# EAGLE schematic fpga_board_test (EAGLE 9.5.1)
Control Board
REVISION: v3.0; TEAM: RoboCup SSL

## Sheet 1 of 4: Microcontroller
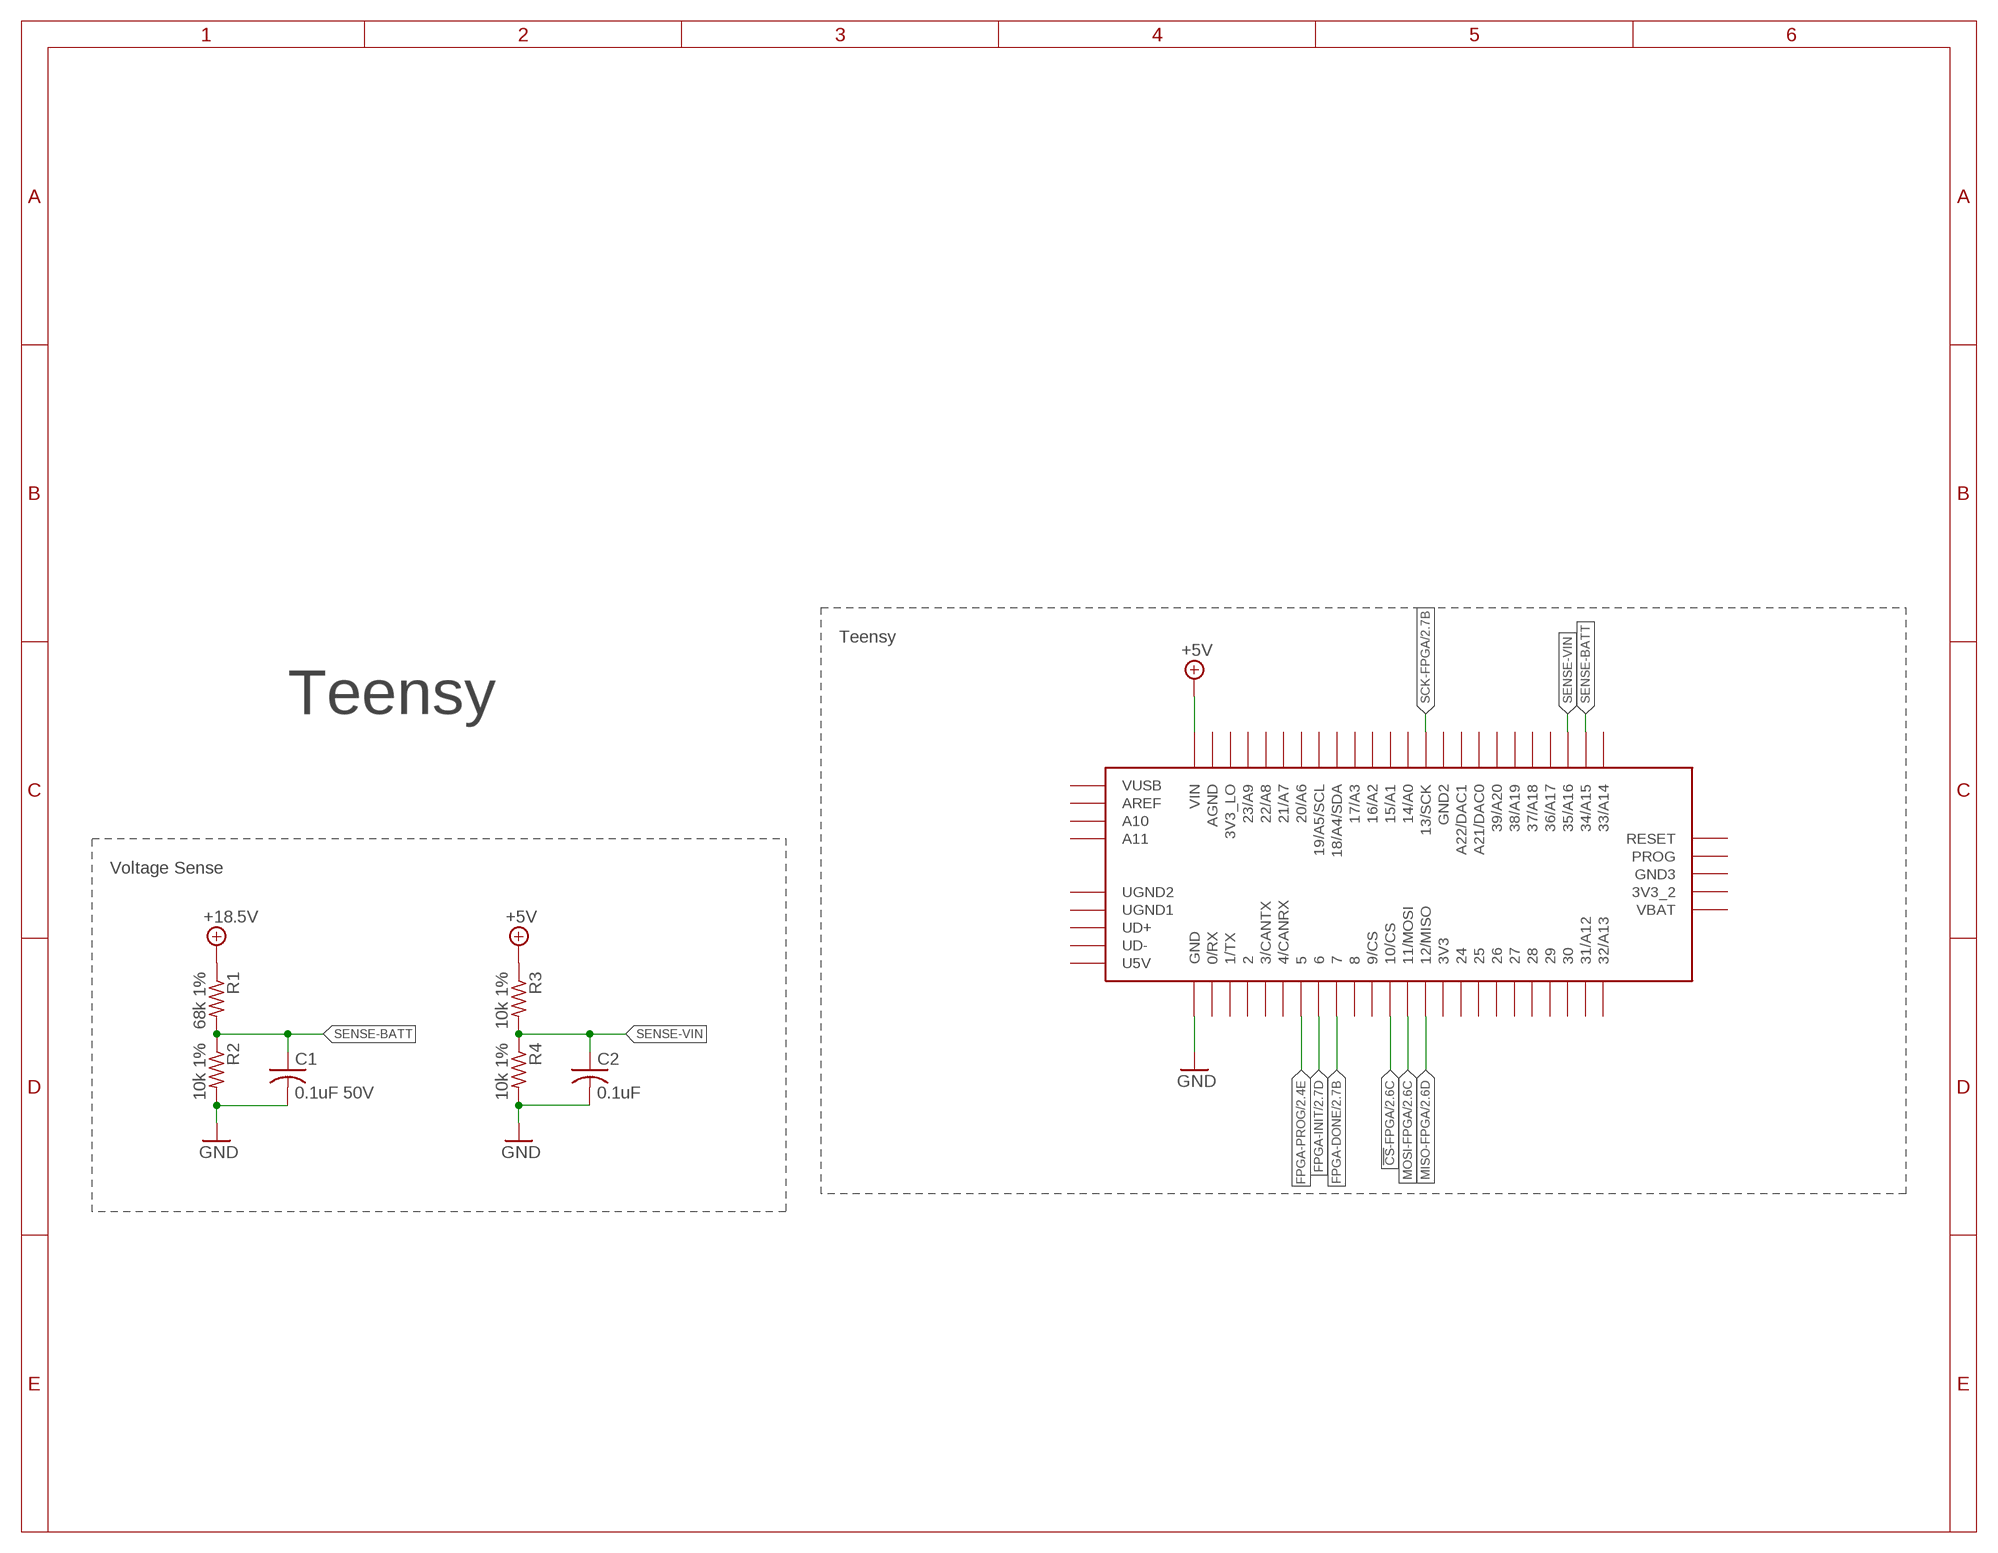
[diagram p0: schematic, sheet 1]
FRAME1 (FRAME_A_L): REVISION: v0.1; SCH_DESC: Teensy; TEAM: Cambridge FC

### Parts
C1  0.1uF 50V  C-USC0603  [C0603]
C2  0.1uF  C-USC0603  [C0603]
R1  68k 1%  R-US_R0603  [R0603]
R2  10k 1%  R-US_R0603  [R0603]
R3  10k 1%  R-US_R0603  [R0603]
R4  10k 1%  R-US_R0603  [R0603]
U$10  TEENSY_3.5/3.6  [TEENSY_3.5/3.6]

### Nets
!CS!-FPGA: U$10.10/CS ; also sheet 2
+5V: R3.1 U$10.VIN ; also sheet 3,4
+18.5V: R1.1 ; also sheet 2,3,4
FPGA-DONE: U$10.7 ; also sheet 2
FPGA-INIT: U$10.6 ; also sheet 2
FPGA-PROG: U$10.5 ; also sheet 2
GND: C1.2 C2.2 R2.2 R4.2 U$10.GND ; also sheet 2,3,4
MISO-FPGA: U$10.12/MISO ; also sheet 2
MOSI-FPGA: U$10.11/MOSI ; also sheet 2
SCK-FPGA: U$10.13/SCK ; also sheet 2
SENSE-BATT: C1.1 R1.2 R2.1 U$10.34/A15
SENSE-VIN: C2.1 R3.2 R4.1 U$10.35/A16
Unconnected: U$10.0/RX U$10.1/TX U$10.2 U$10.3/CANTX U$10.3V3 U$10.3V3_2 U$10.3V3_LO U$10.4/CANRX U$10.8 U$10.9/CS U$10.14/A0 U$10.15/A1 U$10.16/A2 U$10.17/A3 U$10.18/A4/SDA U$10.19/A5/SCL U$10.20/A6 U$10.21/A7 U$10.21/DAC0(A21/DAC0) U$10.22/A8 U$10.23/A9 U$10.24 U$10.25 U$10.26 U$10.27 U$10.28 U$10.29 U$10.30 U$10.31/A12 U$10.32/A13 U$10.33/A14 U$10.36/A17 U$10.37/A18 U$10.38/A19 U$10.39/A20 U$10.A10 U$10.A11 U$10.A22/DAC1 U$10.AGND U$10.AREF U$10.GND2 U$10.GND3 U$10.PROG U$10.RESET U$10.U5V U$10.UD+ U$10.UD- U$10.UGND1 U$10.UGND2 U$10.VBAT U$10.VUSB

### Notes on the sheet
- Teensy
- Teensy
- Voltage Sense

## Sheet 2 of 4: FPGA
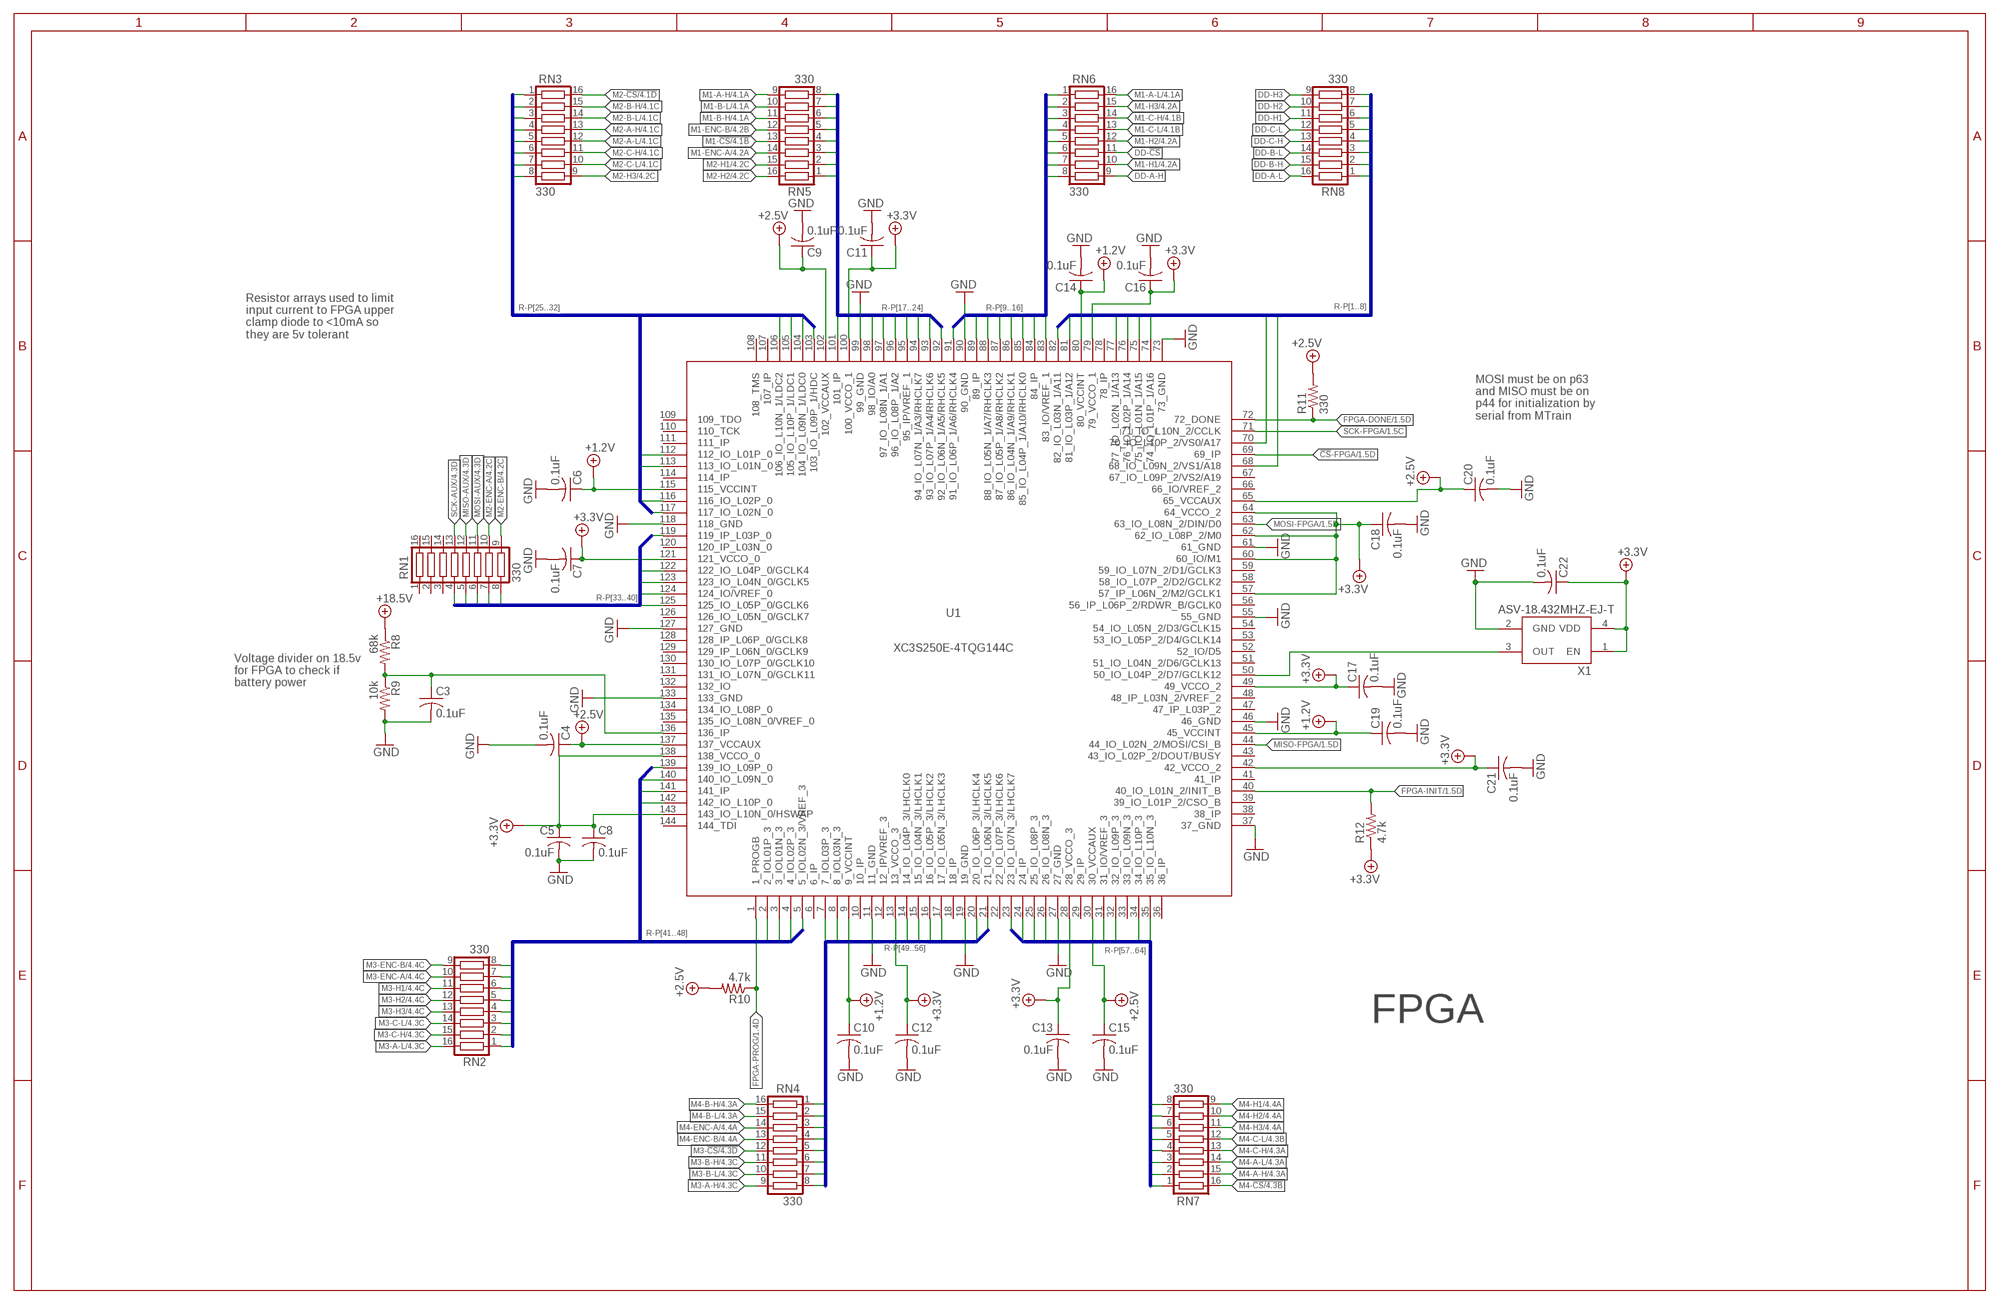
[diagram p1: schematic, sheet 2]
FRAME2 (FRAME_B_L): REVISION: v3.3; SCH_DESC: FPGA

### Parts
C3  0.1uF  C-USC0603  [C0603]
C4  0.1uF  C-USC0603  [C0603]
C5  0.1uF  C-USC0603  [C0603]
C6  0.1uF  C-USC0603  [C0603]
C7  0.1uF  C-USC0603  [C0603]
C8  0.1uF  C-USC0603  [C0603]
C9  0.1uF  C-USC0603  [C0603]
C10  0.1uF  C-USC0603  [C0603]
C11  0.1uF  C-USC0603  [C0603]
C12  0.1uF  C-USC0603  [C0603]
C13  0.1uF  C-USC0603  [C0603]
C14  0.1uF  C-USC0603  [C0603]
C15  0.1uF  C-USC0603  [C0603]
C16  0.1uF  C-USC0603  [C0603]
C17  0.1uF  C-USC0603  [C0603]
C18  0.1uF  C-USC0603  [C0603]
C19  0.1uF  C-USC0603  [C0603]
C20  0.1uF  C-USC0603  [C0603]
C21  0.1uF  C-USC0603  [C0603]
C22  0.1uF  C-USC0603  [C0603]
R8  68k  R-US_R0603  [R0603]
R9  10k  R-US_R0603  [R0603]
R10  4.7k  R-US_R0603  [R0603]
R11  330  R-US_R0603  [R0603]
R12  4.7k  R-US_R0603  [R0603]
RN1  330  RA-8  [RA-8_2506]
RN2  330  RA-8  [RA-8_2506]
RN3  330  RA-8  [RA-8_2506]
RN4  330  RA-8  [RA-8_2506]
RN5  330  RA-8  [RA-8_2506]
RN6  330  RA-8  [RA-8_2506]
RN7  330  RA-8  [RA-8_2506]
RN8  330  RA-8  [RA-8_2506]
U1  XC3S250E-4TQG144C  [TQFP144]
X1  ASV-18.432MHZ-EJ-T  [ASV]

### Nets
!CS!-FPGA: U1.69(69_IP) ; also sheet 1
+1.2V: C6.1 C10.1 C14.1 C19.1 U1.9(9_VCCINT) U1.45(45_VCCINT) U1.80(80_VCCINT) U1.115(115_VCCINT) ; also sheet 3
+2.5V: C4.1 C9.1 C15.1 C20.1 R10.2 R11.2 U1.30(30_VCCAUX) U1.65(65_VCCAUX) U1.102(102_VCCAUX) U1.137(137_VCCAUX) ; also sheet 3
+3.3V: C5.1 C7.1 C8.1 C11.1 C12.1 C13.1 C16.1 C17.1 C18.1 C21.1 C22.1 R12.1 U1.13(13_VCCO_3) U1.28(28_VCCO_3) U1.42(42_VCCO_2) U1.49(49_VCCO_2) U1.57(57_IP_L06N_2/M2/GCLK1) U1.60(60_IO/M1) U1.62(62_IO_L08P_2/M0) U1.64(64_VCCO_2) U1.79(79_VCCO_1) U1.100(100_VCCO_1) U1.121(121_VCCO_0) U1.138(138_VCCO_0) U1.143(143_IO_L10N_0/HSWAP) X1.1(EN) X1.4(VDD) ; also sheet 3,4
+18.5V: R8.1 ; also sheet 1,3,4
BATT-FPGA: C3.1 R8.2 R9.1 U1.136(136_IP)
DD-!CS: RN6.11
DD-A-H: RN6.9
DD-A-L: RN8.16
DD-B-H: RN8.15
DD-B-L: RN8.14
DD-C-H: RN8.13
DD-C-L: RN8.12
DD-H1: RN8.11
DD-H2: RN8.10
DD-H3: RN8.9
FPGA-CLK: U1.50(50_IO_L04P_2/D7/GCLK12) X1.3(OUT)
FPGA-DONE: R11.1 U1.72(72_DONE) ; also sheet 1
FPGA-INIT: R12.2 U1.40(40_IO_L01N_2/INIT_B) ; also sheet 1
FPGA-PROG: R10.1 U1.1(1_PROGB) ; also sheet 1
GND: C3.2 C4.2 C5.2 C6.2 C7.2 C8.2 C9.2 C10.2 C11.2 C12.2 C13.2 C14.2 C15.2 C16.2 C17.2 C18.2 C19.2 C20.2 C21.2 C22.2 R9.2 U1.11(11_GND) U1.19(19_GND) U1.27(27_GND) U1.37(37_GND) U1.46(46_GND) U1.55(55_GND) U1.61(61_GND) U1.73(73_GND) U1.90(90_GND) U1.99(99_GND) U1.118(118_GND) U1.127(127_GND) U1.133(133_GND) X1.2(GND) ; also sheet 1,3,4
M1-!CS: RN5.13 ; also sheet 4
M1-A-H: RN5.9 ; also sheet 4
M1-A-L: RN6.16 ; also sheet 4
M1-B-H: RN5.11 ; also sheet 4
M1-B-L: RN5.10 ; also sheet 4
M1-C-H: RN6.14 ; also sheet 4
M1-C-L: RN6.13 ; also sheet 4
M1-ENC-A: RN5.14 ; also sheet 4
M1-ENC-B: RN5.12 ; also sheet 4
M1-H1: RN6.10 ; also sheet 4
M1-H2: RN6.12 ; also sheet 4
M1-H3: RN6.15 ; also sheet 4
M2-!CS: RN3.16 ; also sheet 4
M2-A-H: RN3.13 ; also sheet 4
M2-A-L: RN3.12 ; also sheet 4
M2-B-H: RN3.15 ; also sheet 4
M2-B-L: RN3.14 ; also sheet 4
M2-C-H: RN3.11 ; also sheet 4
M2-C-L: RN3.10 ; also sheet 4
M2-ENC-A: RN1.10 ; also sheet 4
M2-ENC-B: RN1.9 ; also sheet 4
M2-H1: RN5.15 ; also sheet 4
M2-H2: RN5.16 ; also sheet 4
M2-H3: RN3.9 ; also sheet 4
M3-!CS: RN4.12 ; also sheet 4
M3-A-H: RN4.9 ; also sheet 4
M3-A-L: RN2.16 ; also sheet 4
M3-B-H: RN4.11 ; also sheet 4
M3-B-L: RN4.10 ; also sheet 4
M3-C-H: RN2.15 ; also sheet 4
M3-C-L: RN2.14 ; also sheet 4
M3-ENC-A: RN2.10 ; also sheet 4
M3-ENC-B: RN2.9 ; also sheet 4
M3-H1: RN2.11 ; also sheet 4
M3-H2: RN2.12 ; also sheet 4
M3-H3: RN2.13 ; also sheet 4
M4-!CS: RN7.16 ; also sheet 4
M4-A-H: RN7.15 ; also sheet 4
M4-A-L: RN7.14 ; also sheet 4
M4-B-H: RN4.16 ; also sheet 4
M4-B-L: RN4.15 ; also sheet 4
M4-C-H: RN7.13 ; also sheet 4
M4-C-L: RN7.12 ; also sheet 4
M4-ENC-A: RN4.14 ; also sheet 4
M4-ENC-B: RN4.13 ; also sheet 4
M4-H1: RN7.9 ; also sheet 4
M4-H2: RN7.10 ; also sheet 4
M4-H3: RN7.11 ; also sheet 4
MISO-AUX: RN1.12 ; also sheet 4
MISO-FPGA: U1.44(44_IO_L02N_2/MOSI/CSI_B) ; also sheet 1
MOSI-AUX: RN1.11 ; also sheet 4
MOSI-FPGA: U1.63(63_IO_L08N_2/DIN/D0) ; also sheet 1
R-P1: RN8.1 U1.82(82_IO_L03N_1/A11)
R-P2: RN8.2 U1.81(81_IO_L03P_1/A12)
R-P3: RN8.3 U1.77(77_IO_L02N_1/A13)
R-P4: RN8.4 U1.76(76_IO_L02P_1/A14)
R-P5: RN8.5 U1.75(75_IO_L01N_1/A15)
R-P6: RN8.6 U1.74(74_IO_L01P_1/A16)
R-P7: RN8.7 U1.70(70_IO_L10P_2/VS0/A17)
R-P8: RN8.8 U1.68(68_IO_L09N_2/VS1/A18)
R-P9: RN6.1 U1.91(91_IO_L06P_1/A6/RHCLK4)
R-P10: RN6.2 U1.89(89_IP)
R-P11: RN6.3 U1.88(88_IO_L05N_1/A7/RHCLK3)
R-P12: RN6.4 U1.87(87_IO_L05P_1/A8/RHCLK2)
R-P13: RN6.5 U1.86(86_IO_L04N_1/A9/RHCLK1)
R-P14: RN6.6 U1.85(85_IO_L04P_1/A10/RHCLK0)
R-P15: RN6.7 U1.84(84_IP)
R-P16: RN6.8 U1.83(83_IO/VREF_1)
R-P17: RN5.1 U1.101(101_IP)
R-P18: RN5.2 U1.98(98_IO/A0)
R-P19: RN5.3 U1.97(97_IO_L08N_1/A1)
R-P20: RN5.4 U1.96(96_IO_L08P_1/A2)
R-P21: RN5.5 U1.95(95_IP/VREF_1)
R-P22: RN5.6 U1.94(94_IO_L07N_1/A3/RHCLK7)
R-P23: RN5.7 U1.93(93_IO_L07P_1/A4/RHCLK6)
R-P24: RN5.8 U1.92(92_IO_L06N_1/A5/RHCLK5)
R-P25: RN3.1 U1.117(117_IO_L02N_0)
R-P26: RN3.2 U1.116(116_IO_L02P_0)
R-P27: RN3.3 U1.113(113_IO_L01N_0)
R-P28: RN3.4 U1.112(112_IO_L01P_0)
R-P29: RN3.5 U1.106(106_IO_L10N_1/LDC2)
R-P30: RN3.6 U1.105(105_IO_L10P_1/LDC1)
R-P31: RN3.7 U1.104(104_IO_L09N_1/LDC0)
R-P32: RN3.8 U1.103(103_IO_L09P_1/HDC)
R-P36: RN1.4 U1.125(125_IO_L05P_0/GCLK6)
R-P37: RN1.5 U1.124(124_IO/VREF_0)
R-P38: RN1.6 U1.123(123_IO_L04N_0/GCLK5)
R-P39: RN1.7 U1.122(122_IO_L04P_0/GCLK4)
R-P40: RN1.8 U1.119(119_IP_L03P_0)
R-P41: RN2.1 U1.5(5_IOL02N_3/VREF_3)
R-P42: RN2.2 U1.4(4_IOL02P_3)
R-P43: RN2.3 U1.3(3_IOL01N_3)
R-P44: RN2.4 U1.2(2_IOL01P_3)
R-P45: RN2.5 U1.142(142_IO_L10P_0)
R-P46: RN2.6 U1.141(141_IP)
R-P47: RN2.7 U1.140(140_IO_L09N_0)
R-P48: RN2.8 U1.139(139_IO_L09P_0)
R-P49: RN4.1 U1.21(21_IO_L06N_3/LHCLK5)
R-P50: RN4.2 U1.20(20_IO_L06P_3/LHCLK4)
R-P51: RN4.3 U1.17(17_IO_L05N_3/LHCLK3)
R-P52: RN4.4 U1.16(16_IO_L05P_3/LHCLK2)
R-P53: RN4.5 U1.15(15_IO_L04N_3/LHCLK1)
R-P54: RN4.6 U1.14(14_IO_L04P_3/LHCLK0)
R-P55: RN4.7 U1.8(8_IOL03N_3)
R-P56: RN4.8 U1.7(7_IOL03P_3)
R-P57: RN7.1 U1.35(35_IO_L10N_3)
R-P58: RN7.2 U1.34(34_IO_L10P_3)
R-P59: RN7.3 U1.32(32_IO_L09P_3)
R-P60: RN7.4 U1.31(31_IO/VREF_3)
R-P61: RN7.5 U1.26(26_IO_L08N_3)
R-P62: RN7.6 U1.25(25_IO_L08P_3)
R-P63: RN7.7 U1.24(24_IP)
R-P64: RN7.8 U1.23(23_IO_L07N_3/LHCLK7)
SCK-AUX: RN1.13 ; also sheet 4
SCK-FPGA: U1.71(71_IO_L10N_2/CCLK) ; also sheet 1
Unconnected: RN1.1 RN1.2 RN1.3 RN1.14 RN1.15 RN1.16 U1.6(6_IP) U1.10(10_IP) U1.12(12_IP/VREF_3) U1.18(18_IP) U1.22(22_IO_L07P_3/LHCLK6) U1.29(29_IP) U1.33(33_IO_L09N_3) U1.36(36_IP) U1.38(38_IP) U1.39(39_IO_L01P_2/CSO_B) U1.41(41_IP) U1.43(43_IO_L02P_2/DOUT/BUSY) U1.47(47_IP_L03P_2) U1.48(48_IP_L03N_2/VREF_2) U1.51(51_IO_L04N_2/D6/GCLK13) U1.52(52_IO/D5) U1.53(53_IO_L05P_2/D4/GCLK14) U1.54(54_IO_L05N_2/D3/GCLK15) U1.56(56_IP_L06P_2/RDWR_B/GCLK0) U1.58(58_IO_L07P_2/D2/GCLK2) U1.59(59_IO_L07N_2/D1/GCLK3) U1.66(66_IO/VREF_2) U1.67(67_IO_L09P_2/VS2/A19) U1.78(78_IP) U1.107(107_IP) U1.108(108_TMS) U1.109(109_TDO) U1.110(110_TCK) U1.111(111_IP) U1.114(114_IP) U1.120(120_IP_L03N_0) U1.126(126_IO_L05N_0/GCLK7) U1.128(128_IP_L06P_0/GCLK8) U1.129(129_IP_L06N_0/GCLK9) U1.130(130_IO_L07P_0/GCLK10) U1.131(131_IO_L07N_0/GCLK11) U1.132(132_IO) U1.134(134_IO_L08P_0) U1.135(135_IO_L08N_0/VREF_0) U1.144(144_TDI)

### Buses
R-P[1..8]
R-P[9..16]
R-P[17..24]
R-P[25..32]
R-P[33..40]
R-P[49..56]
R-P[57..64]
R-P[41..48]

### Notes on the sheet
- Resistor arrays used to limit
  input current to FPGA upper
  clamp diode to <10mA so
  they are 5v tolerant
- MOSI must be on p63
  and MISO must be on
  p44 for initialization by
  serial from MTrain
- Voltage divider on 18.5v
  for FPGA to check if 
  battery power
- FPGA

## Sheet 3 of 4: Power Deliverey Circuits
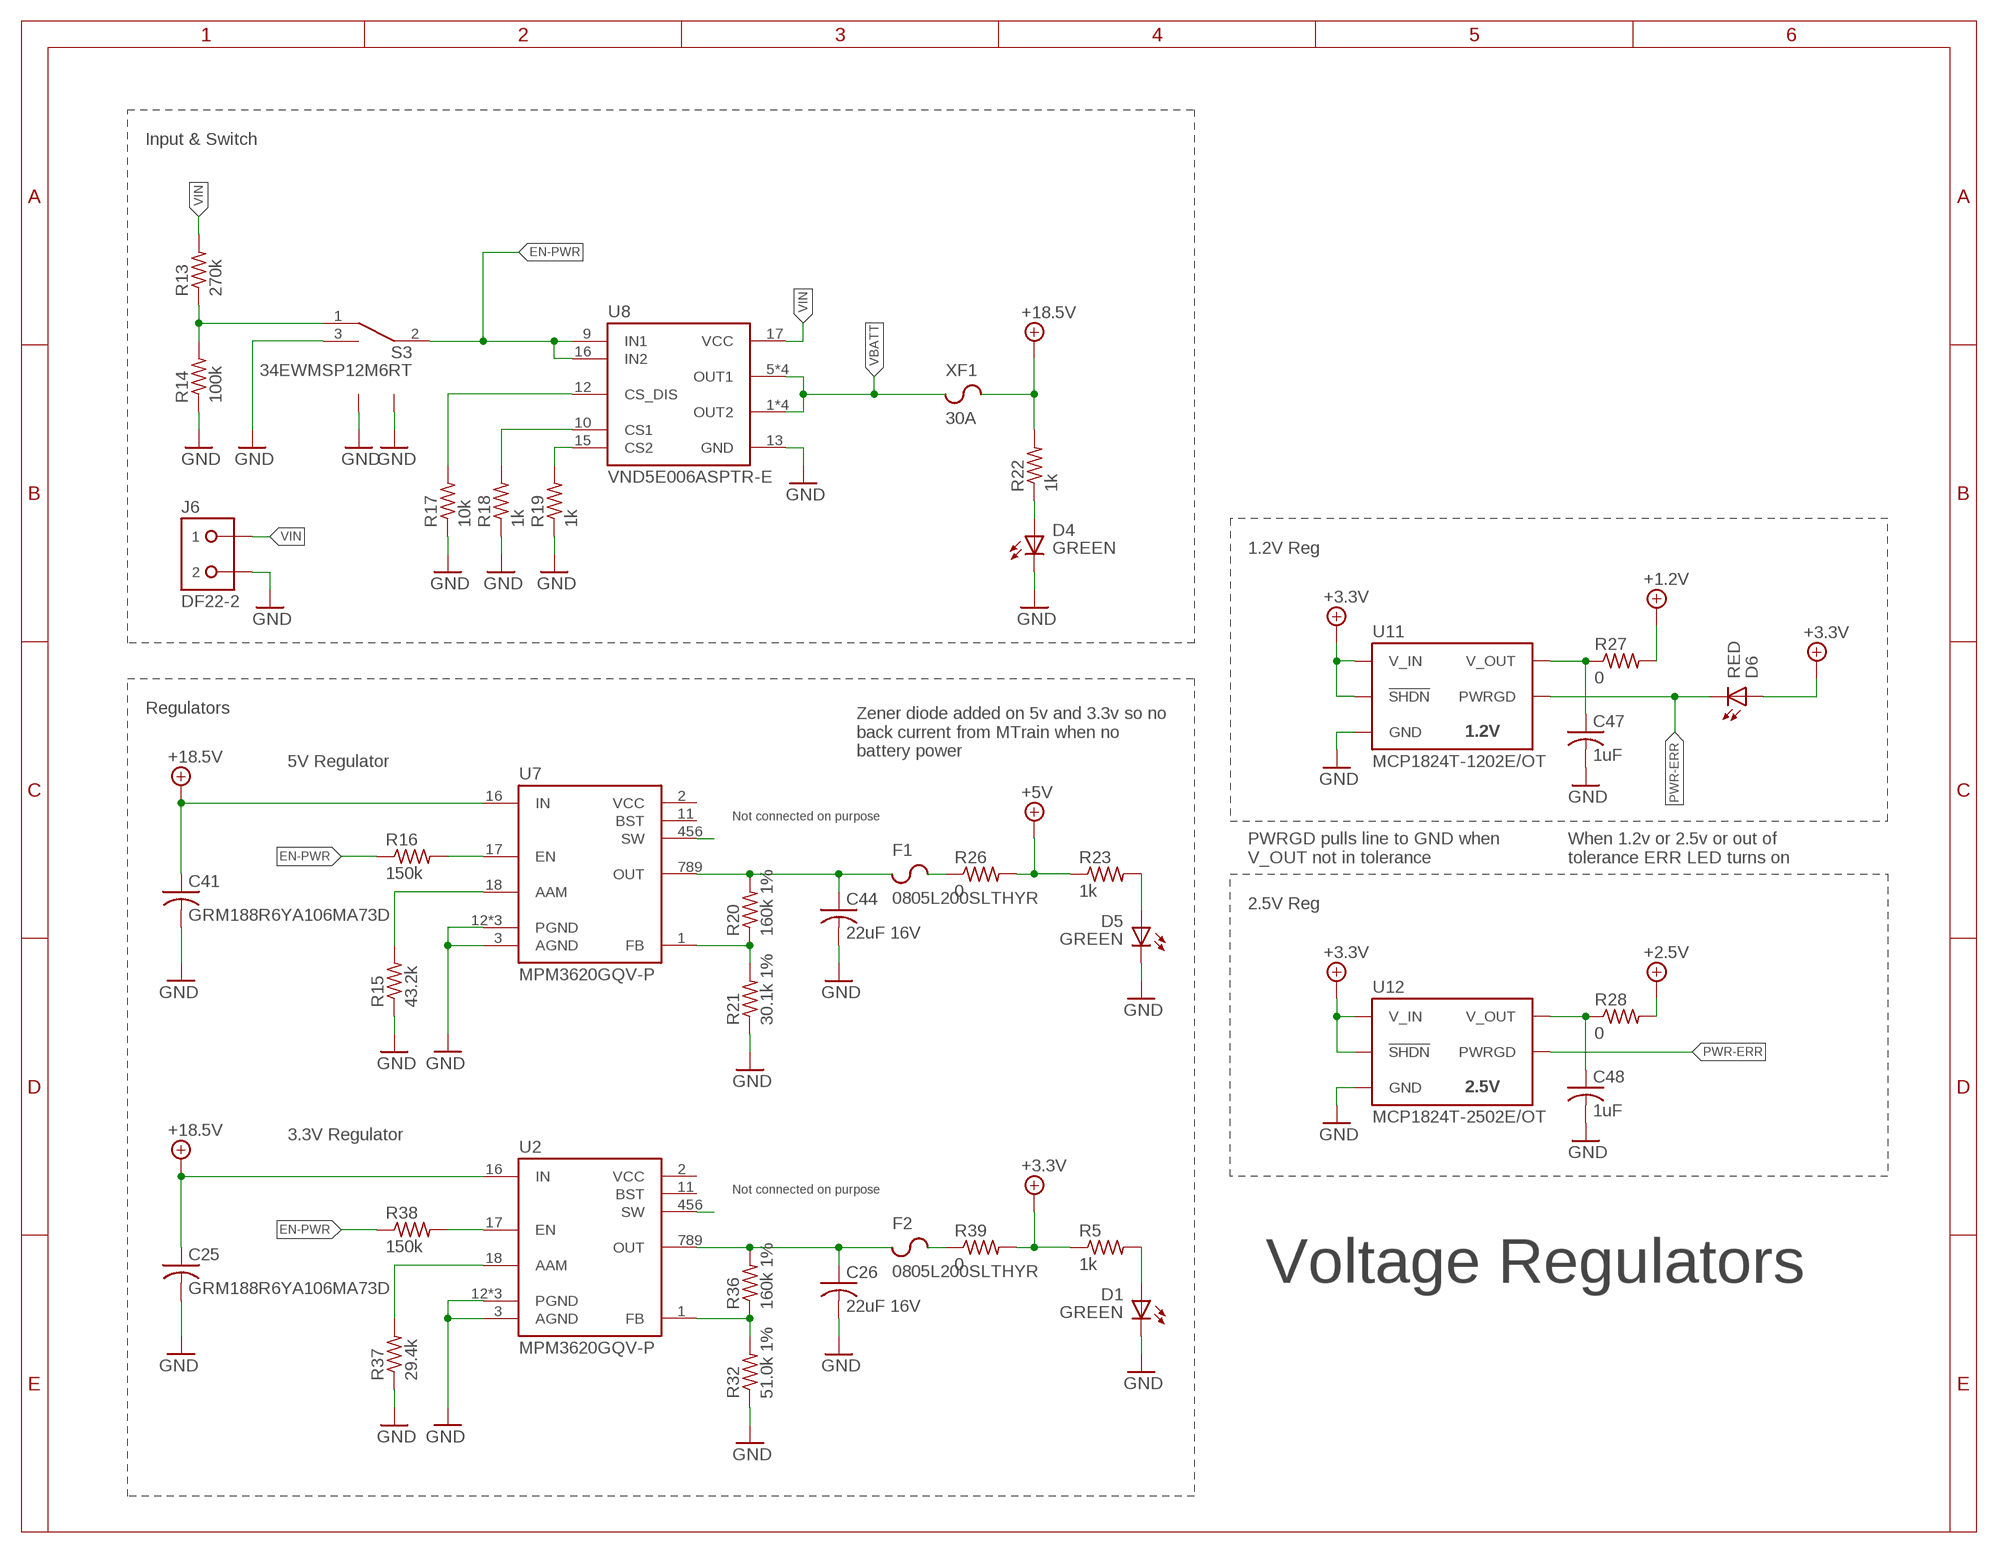
[diagram p2: schematic, sheet 3]
FRAME5 (FRAME_A_L): REVISION: v3.3; SCH_DESC: Power Delivery Circuits

### Parts
C25  GRM188R6YA106MA73D  C-USC0603  [C0603]
C26  22uF 16V  C-USC0805  [C0805]
C41  GRM188R6YA106MA73D  C-USC0603  [C0603]
C44  22uF 16V  C-USC0805  [C0805]
C47  1uF  C-USC0603  [C0603]
C48  1uF  C-USC0603  [C0603]
D1  GREEN  LED-SMD-GREEN  [CHIP-LED0603]
D4  GREEN  LED-SMD-GREEN  [CHIP-LED0603]
D5  GREEN  LED-SMD-GREEN  [CHIP-LED0603]
D6  RED  LED-SMD-RED  [CHIP-LED0603]
F1  0805L200SLTHYR  CHIP_FUSE0805  [FUSC2113X75]
F2  0805L200SLTHYR  CHIP_FUSE0805  [FUSC2113X75]
J6  DF22-2  [DF22-2-H]
R5  1k  R-US_R0603  [R0603]
R13  270k  R-US_R0603  [R0603]
R14  100k  R-US_R0603  [R0603]
R15  43.2k  R-US_R0603  [R0603]
R16  150k  R-US_R0603  [R0603]
R17  10k  R-US_R0603  [R0603]
R18  1k  R-US_R0603  [R0603]
R19  1k  R-US_R0603  [R0603]
R20  160k 1%  R-US_R0603  [R0603]
R21  30.1k 1%  R-US_R0603  [R0603]
R22  1k  R-US_R0603  [R0603]
R23  1k  R-US_R0603  [R0603]
R26  0  R-US_R0603  [R0603]
R27  0  R-US_R0603  [R0603]
R28  0  R-US_R0603  [R0603]
R32  51.0k 1%  R-US_R0603  [R0603]
R36  160k 1%  R-US_R0603  [R0603]
R37  29.4k  R-US_R0603  [R0603]
R38  150k  R-US_R0603  [R0603]
R39  0  R-US_R0603  [R0603]
S3  34EWMSP12M6RT  [34EWMSP12M6RT]
U2  MPM3620GQV-P  [MPM3620GQV-P]
U7  MPM3620GQV-P  [MPM3620GQV-P]
U8  VND5E006ASPTR-E  [POWERSO-16]
U11  MCP1824T-1202E/OT  [SOT-23-5]
U12  MCP1824T-2502E/OT  [SOT-23-5]
XF1  30A  3557-2  [3557-2]

### Nets
5V-LED: D5.A R23.2
5V-LED1: D1.A R5.2
18.5V-LED: D4.A R22.1
+1.2V: R27.2 ; also sheet 2
+1.2V-PRE: C47.1 R27.1 U11.5(V_OUT)
+2.5V: R28.2 ; also sheet 2
+2.5V-PRE: C48.1 R28.1 U12.5(V_OUT)
+3.3V: D6.A R5.1 R39.2 U11.1(V_IN) U11.3(!SHDN) U12.1(V_IN) U12.3(!SHDN) ; also sheet 2,4
+3.3V-FUSE: C26.1 F2.1 R36.2 U2.789(OUT)
+5V: R23.1 R26.2 ; also sheet 1,4
+5V-FUSE: C44.1 F1.1 R20.2 U7.789(OUT)
+18.5V: C25.1 C41.1 R22.2 U2.16(IN) U7.16(IN) XF1.3 XF1.4 ; also sheet 1,2,4
AAM: R15.2 U7.18(AAM)
AAM1: R37.2 U2.18(AAM)
CS1: R18.2 U8.10(CS1)
CS2: R19.2 U8.15(CS2)
CS-DIS: R17.2 U8.12(CS_DIS)
EN: R16.2 U7.17(EN)
EN1: R38.2 U2.17(EN)
EN-PWR: R16.1 R38.1 S3.2(COMMON) U8.9(IN1) U8.16(IN2)
EN-PWR-PRE: R13.1 R14.2 S3.1(A)
FB: R20.1 R21.2 U7.1(FB)
FB1: R32.2 R36.1 U2.1(FB)
GND: C25.2 C26.2 C41.2 C44.2 C47.2 C48.2 D1.C(K) D4.C(K) D5.C(K) J6.2 R14.1 R15.1 R17.1 R18.1 R19.1 R21.1 R32.1 R37.1 S3.3(B) S3.LEG1 S3.LEG3(LEG2) U2.3(AGND) U2.12(PGND) U2.13(PGND) U2.14(PGND) U7.3(AGND) U7.12(PGND) U7.13(PGND) U7.14(PGND) U8.13(GND) U11.2(GND) U12.2(GND) ; also sheet 1,2,4
N$1: F2.2 R39.1
N$2: F1.2 R26.1
PWR-ERR: D6.C(K) U11.4(PWRGD) U12.4(PWRGD)
SW: U7.456(SW)
SW1: U2.456(SW)
VBATT: U8.1(OUT2) U8.2(OUT2) U8.3(OUT2) U8.4(OUT2) U8.5(OUT1) U8.6(OUT1) U8.7(OUT1) U8.8(OUT1) XF1.1 XF1.2
VIN: J6.1 R13.2 U8.17(VCC)
Unconnected: U2.2(VCC) U2.11(BST) U7.2(VCC) U7.11(BST)

### Notes on the sheet
- Input & Switch
- 1.2V Reg
- Regulators
- Zener diode added on 5v and 3.3v so no
  back current from MTrain when no
  battery power
- 5V Regulator
- Not connected on purpose
- PWRGD pulls line to GND when
  V_OUT not in tolerance
- When 1.2v or 2.5v or out of
  tolerance ERR LED turns on
- 2.5V Reg
- 3.3V Regulator
- Not connected on purpose
- Voltage Regulators

## Sheet 4 of 4: Motor Drivers
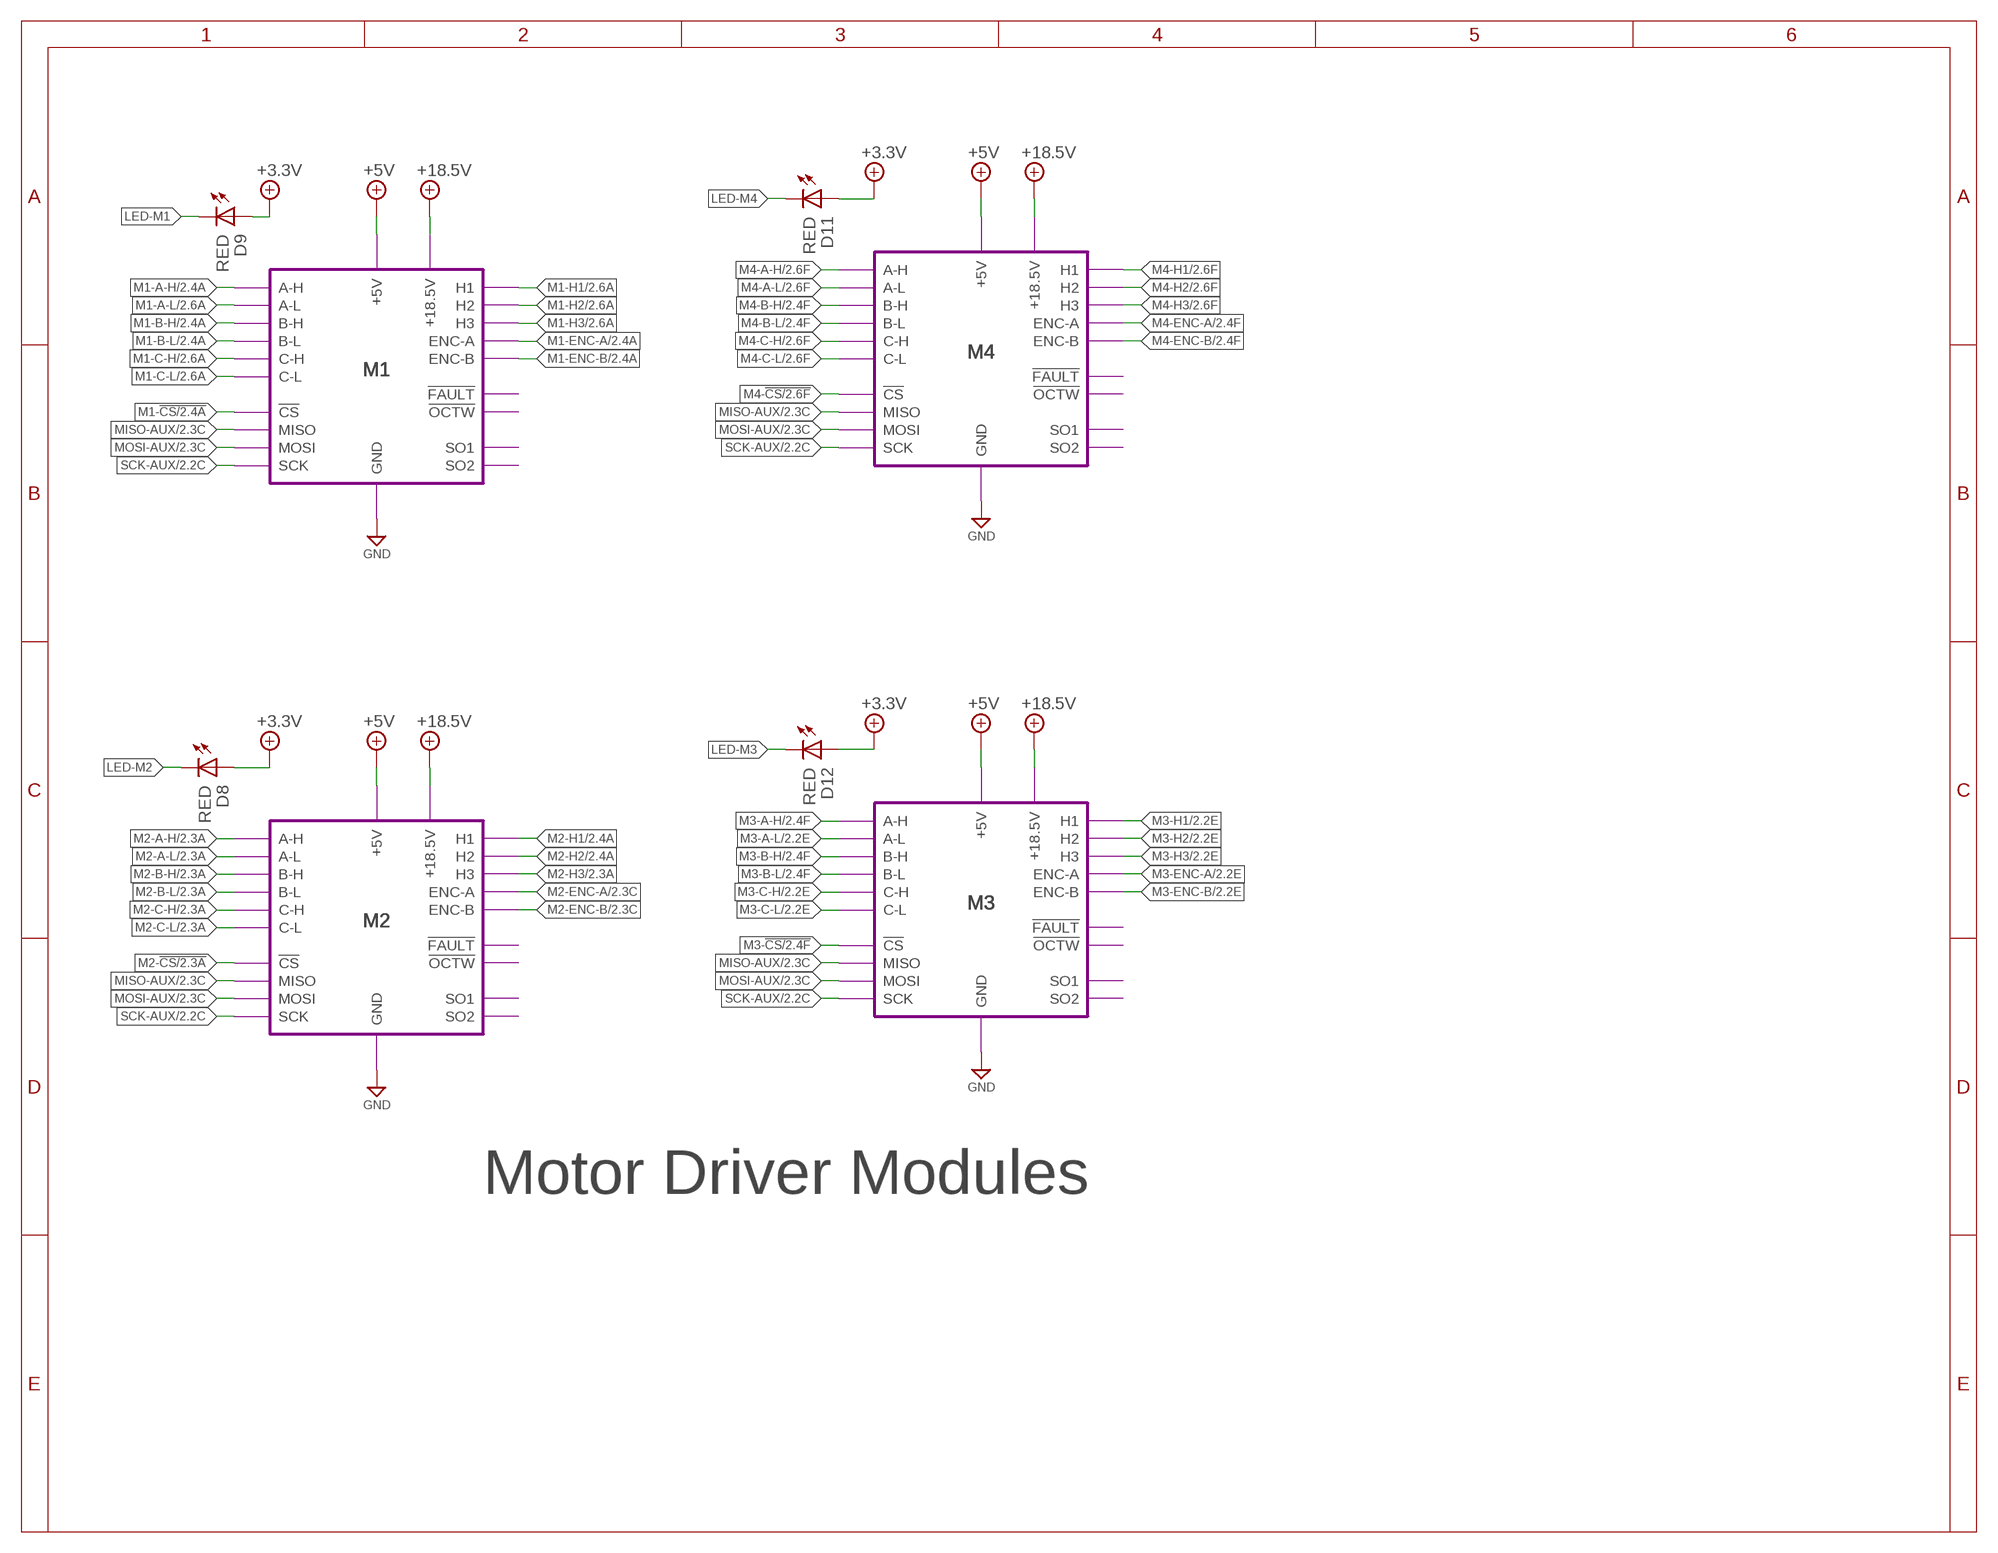
[diagram p3: schematic, sheet 4]
FRAME6 (FRAME_A_L): REVISION: v3.3; SCH_DESC: Motor Drivers

### Parts
D8  RED  LED-SMD-RED  [CHIP-LED0603]
D9  RED  LED-SMD-RED  [CHIP-LED0603]
D11  RED  LED-SMD-RED  [CHIP-LED0603]
D12  RED  LED-SMD-RED  [CHIP-LED0603]

### Module instances
M1 = WHEEL_DRIVE
M2 = WHEEL_DRIVE
M3 = WHEEL_DRIVE
M4 = WHEEL_DRIVE

### Nets
+3.3V: D8.A D9.A D11.A D12.A ; also sheet 2,3
+5V: port M1.+5V M2.+5V M3.+5V M4.+5V ; also sheet 1,3
+18.5V: port M1.+18.5V M4.+18.5V M2.+18.5V M3.+18.5V ; also sheet 1,2,3
GND: port M1.GND M4.GND M3.GND M2.GND ; also sheet 1,2,3
LED-M1: D9.C(K)
LED-M2: D8.C(K)
LED-M3: D12.C(K)
LED-M4: D11.C(K)
M1-!CS: port M1.!CS ; also sheet 2
M1-A-H: port M1.A-H ; also sheet 2
M1-A-L: port M1.A-L ; also sheet 2
M1-B-H: port M1.B-H ; also sheet 2
M1-B-L: port M1.B-L ; also sheet 2
M1-C-H: port M1.C-H ; also sheet 2
M1-C-L: port M1.C-L ; also sheet 2
M1-ENC-A: port M1.ENC-A ; also sheet 2
M1-ENC-B: port M1.ENC-B ; also sheet 2
M1-H1: port M1.H1 ; also sheet 2
M1-H2: port M1.H2 ; also sheet 2
M1-H3: port M1.H3 ; also sheet 2
M2-!CS: port M2.!CS ; also sheet 2
M2-A-H: port M2.A-H ; also sheet 2
M2-A-L: port M2.A-L ; also sheet 2
M2-B-H: port M2.B-H ; also sheet 2
M2-B-L: port M2.B-L ; also sheet 2
M2-C-H: port M2.C-H ; also sheet 2
M2-C-L: port M2.C-L ; also sheet 2
M2-ENC-A: port M2.ENC-A ; also sheet 2
M2-ENC-B: port M2.ENC-B ; also sheet 2
M2-H1: port M2.H1 ; also sheet 2
M2-H2: port M2.H2 ; also sheet 2
M2-H3: port M2.H3 ; also sheet 2
M3-!CS: port M3.!CS ; also sheet 2
M3-A-H: port M3.A-H ; also sheet 2
M3-A-L: port M3.A-L ; also sheet 2
M3-B-H: port M3.B-H ; also sheet 2
M3-B-L: port M3.B-L ; also sheet 2
M3-C-H: port M3.C-H ; also sheet 2
M3-C-L: port M3.C-L ; also sheet 2
M3-ENC-A: port M3.ENC-A ; also sheet 2
M3-ENC-B: port M3.ENC-B ; also sheet 2
M3-H1: port M3.H1 ; also sheet 2
M3-H2: port M3.H2 ; also sheet 2
M3-H3: port M3.H3 ; also sheet 2
M4-!CS: port M4.!CS ; also sheet 2
M4-A-H: port M4.A-H ; also sheet 2
M4-A-L: port M4.A-L ; also sheet 2
M4-B-H: port M4.B-H ; also sheet 2
M4-B-L: port M4.B-L ; also sheet 2
M4-C-H: port M4.C-H ; also sheet 2
M4-C-L: port M4.C-L ; also sheet 2
M4-ENC-A: port M4.ENC-A ; also sheet 2
M4-ENC-B: port M4.ENC-B ; also sheet 2
M4-H1: port M4.H1 ; also sheet 2
M4-H2: port M4.H2 ; also sheet 2
M4-H3: port M4.H3 ; also sheet 2
MISO-AUX: port M1.MISO M2.MISO M4.MISO M3.MISO ; also sheet 2
MOSI-AUX: port M1.MOSI M2.MOSI M4.MOSI M3.MOSI ; also sheet 2
SCK-AUX: port M1.SCK M2.SCK M4.SCK M3.SCK ; also sheet 2

### Notes on the sheet
- Motor Driver Modules

## Library data of the parts
C1-C22 C47 C48 = resistor:C-US: CAPACITOR, American symbol
C25 C41 = rcl:C-US: CAPACITOR, American symbol
C26 C44 = rcl:C-US: CAPACITOR, American symbol; SPICEPREFIX: C
D1 D4 D5 = RoboJackets-LEDs:LED-SMD; DIGIKEY: 160-1446-1-ND; MPN: LTST-C191KGKT
D6 D8 D9 D11 D12 = RoboJackets-LEDs:LED-SMD; DIGIKEY: 160-1447-1-ND; MPN: LTST-C191KRKT
F1 F2 = RoboJackets-Fuses:CHIP_FUSE
J6 = RoboJackets-Connectors:DF22-2; DIGIKEY: H125155-ND; MPN: DF22-2P-7.92DS(35)
R1-R5 R8-R12 R23 R26-R28 R39 = resistor:R-US_: RESISTOR, American symbol
R13 R14 R17-R19 R22 = rcl:R-US_: RESISTOR, American symbol
R15 R16 R20 R21 R32 R36-R38 = rcl:R-US_: RESISTOR, American symbol; SPICEPREFIX: R
RN1-RN8 = RoboJackets-Resistors:RA-8: Resistor Array 8; DIGIKEY: 742C163331JPCT-ND; MPN: 742C163331JP
S3 = RoboJackets-Switches:34EWMSP12M6RT; DIGIKEY: GH7540CT-ND; MPN: 34EWMSP12M6RT
U1 = RoboJackets-ICs:XC3S250E-4TQG144C: Spartan-3E 144pin; DIGIKEY: 122-1524-ND; MPN: XC3S250E-4TQG144C
U2 U7 = RoboJackets-PowerICs:MPM3620GQV-P; DIGIKEY: 1589-1252-1-ND; MPN: MPM3620GQV-P
U8 = RoboJackets-PowerICs:VND5E006ASPTR-E; DIGIKEY: 497-11623-1-ND; MPN: VND5E006ASPTR-E
U11 = RoboJackets-PowerICs:MCP1824T*?; DIGIKEY: MCP1824T-1202E/OTCT-ND; MPN: MCP1824T-1202E/OT; VOLTAGE: 1.2V
U12 = RoboJackets-PowerICs:MCP1824T*?; DIGIKEY: MCP1824T-2502E/OTCT-ND; MPN: MCP1824T-2502E/OT; VOLTAGE: 2.5V
U$10 = Teensy356:TEENSY_3.5/3.6
X1 = RoboJackets-FreqGen:ASV-*; DIGIKEY: 535-9314-1-ND; MPN: ASV-18.432MHZ-EJ-T
XF1 = RoboJackets-Fuses:3557-2; DIGIKEY: 36-3557-2-ND; MPN: 3557-2

## Module TEST
Ports: OUT[0..2](io)

### Library data of the parts

## Module WHEEL_DRIVE
Ports: A-H(io) A-L(io) B-H(io) B-L(io) C-H(io) C-L(io) !CS(io) !FAULT(io) !OCTW(io) +18.5V(io) GND(io) MISO(io) MOSI(io) SCK(io) SO1(io) SO2(io) H1(io) H2(io) H3(io) ENC-A(io) ENC-B(io) +5V(io)
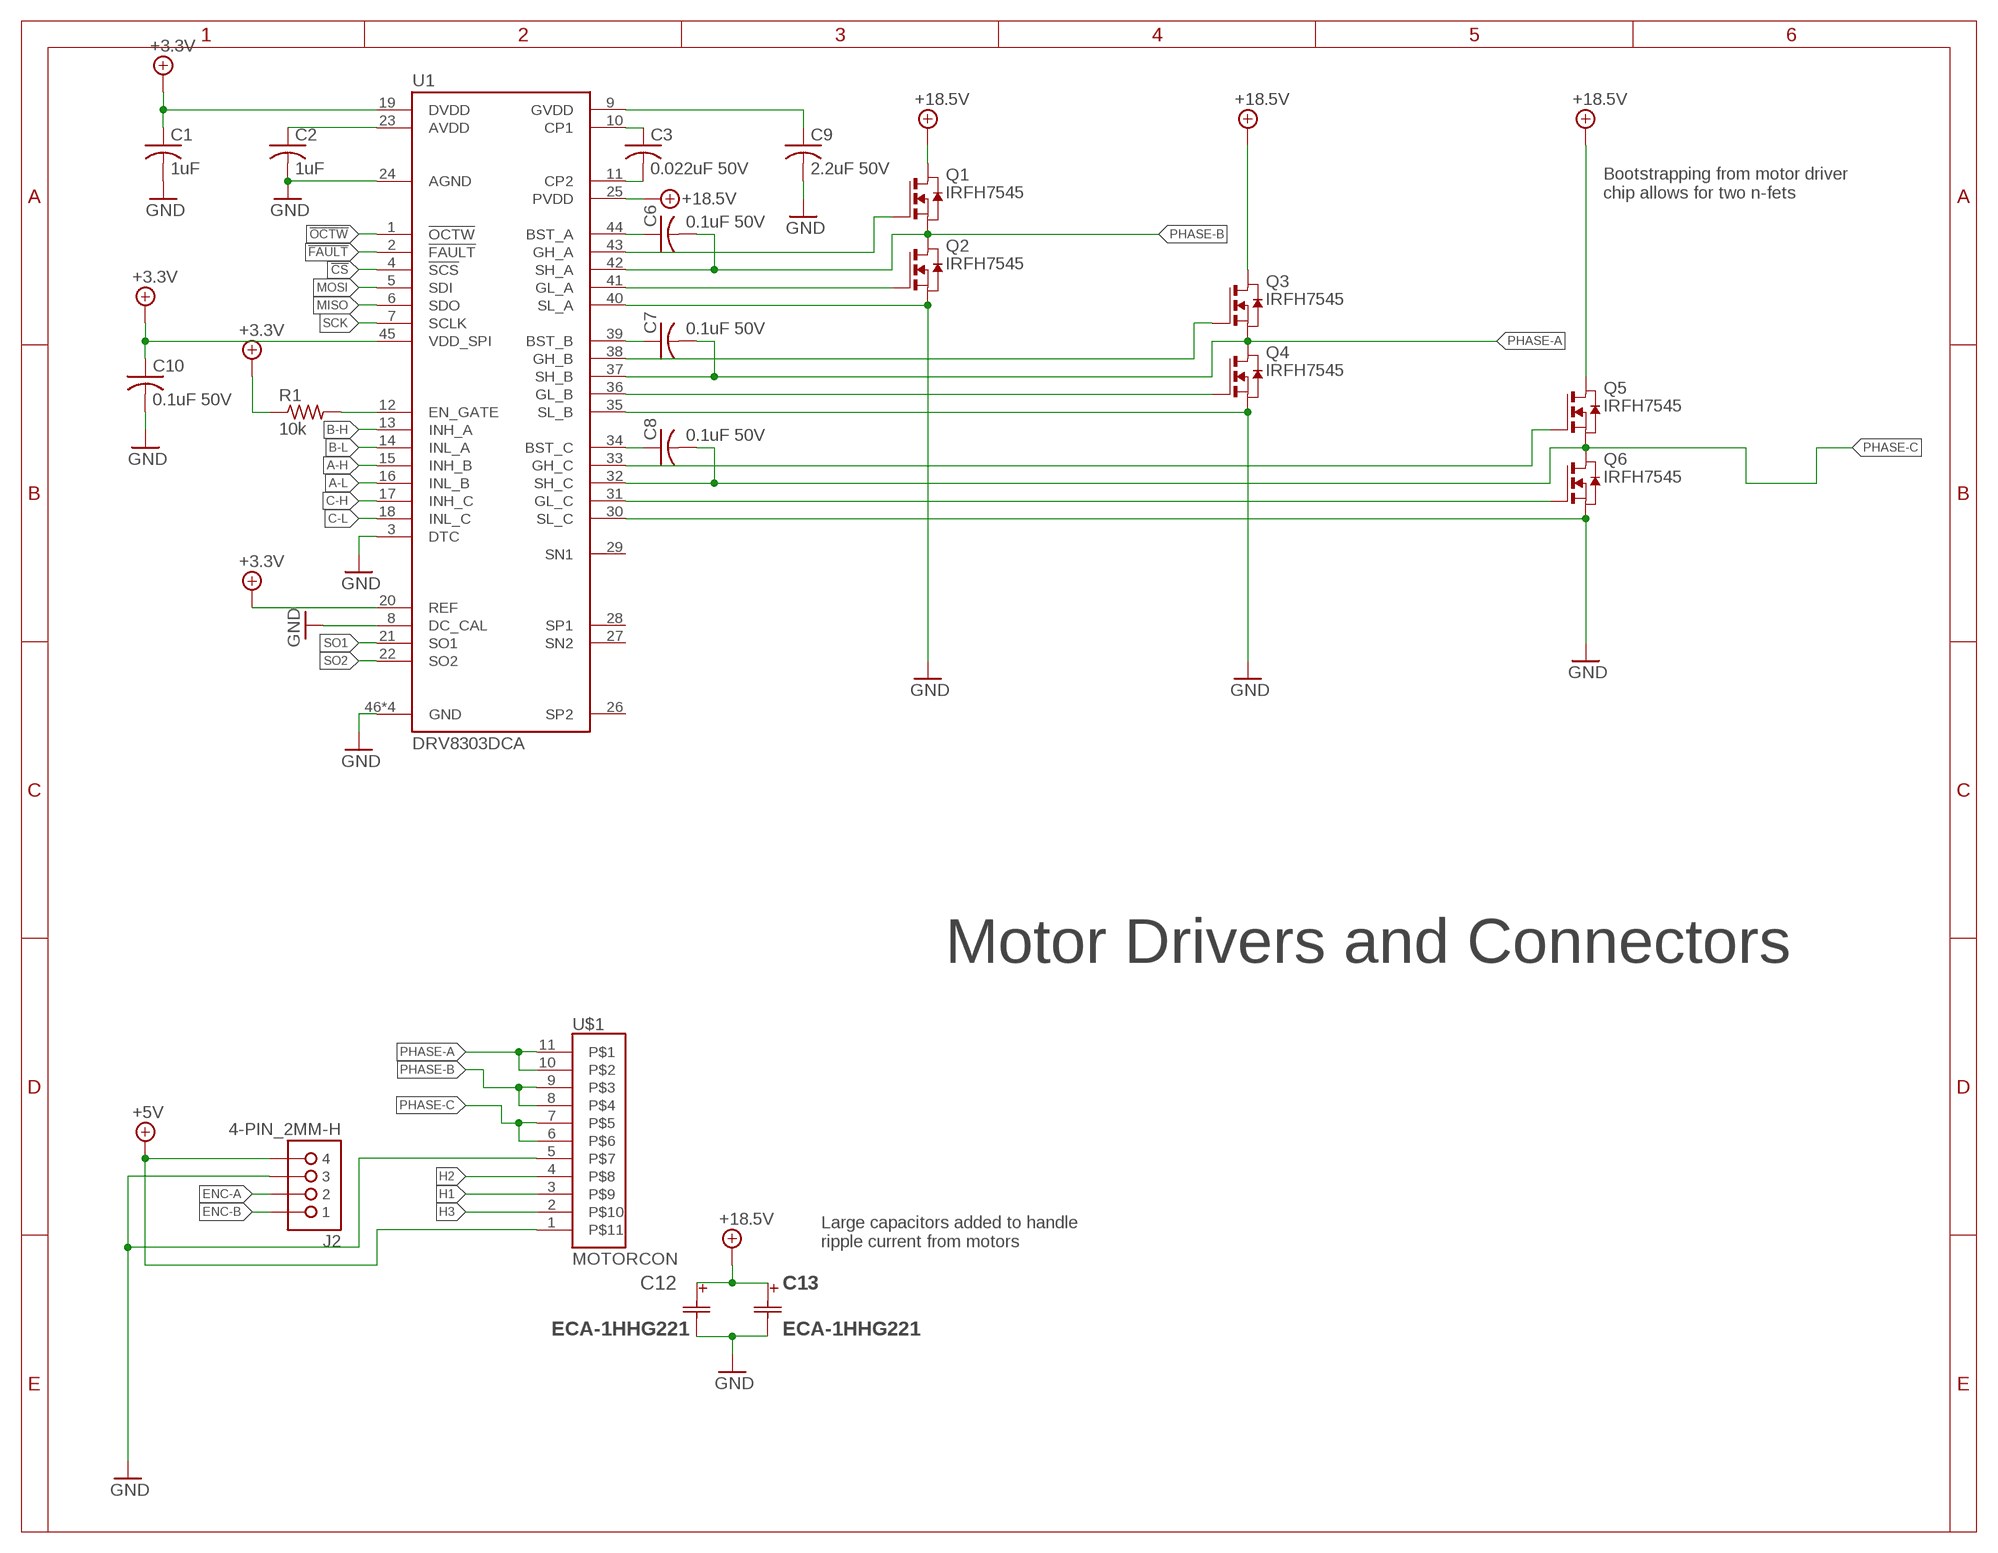
[diagram p4: schematic, module WHEEL_DRIVE, sheet 1]
FRAME1 (FRAME_A_L): REVISION: v3.3; SCH_DESC: Wheel Motor Driver

### Parts
C1  1uF  C-USC0603  [C0603]
C2  1uF  C-USC0603  [C0603]
C3  0.022uF 50V  C-USC0603  [C0603]
C6  0.1uF 50V  C-USC0603  [C0603]
C7  0.1uF 50V  C-USC0603  [C0603]
C8  0.1uF 50V  C-USC0603  [C0603]
C9  2.2uF 50V  C-USC0603  [C0603]
C10  0.1uF 50V  C-USC0603  [C0603]
C12  ECA-1HHG221  [CAP_PAN_10X12.5]
C13  ECA-1HHG221  [CAP_PAN_10X12.5]
J2  4-PIN_2MM-H  [2MM-4-H]
Q1  IRFH7545  [PQFN_5X6_E]
Q2  IRFH7545  [PQFN_5X6_E]
Q3  IRFH7545  [PQFN_5X6_E]
Q4  IRFH7545  [PQFN_5X6_E]
Q5  IRFH7545  [PQFN_5X6_E]
Q6  IRFH7545  [PQFN_5X6_E]
R1  10k  R-US_R0603  [R0603]
U1  DRV8303DCA  [TSSOP-48_PAD]
U$1  MOTORCON  [GEN3CON]

### Nets
!CS: U1.4(!SCS)
!FAULT: U1.2(!FAULT)
!OCTW: U1.1(!OCTW)
+3.3V: C1.1 C10.1 R1.1 U1.19(DVDD) U1.20(REF) U1.45(VDD_SPI)
+5V: J2.4 U$1.1
+18.5V: C12.1 C13.1 Q1.5678(D) Q3.5678(D) Q5.5678(D) U1.25(PVDD)
A-H: U1.15(INH_B)
A-L: U1.16(INL_B)
AVDD: C2.1 U1.23(AVDD)
B-H: U1.13(INH_A)
B-L: U1.14(INL_A)
BST-A: C6.1 U1.44(BST_A)
BST-B: C7.1 U1.39(BST_B)
BST-C: C8.1 U1.34(BST_C)
C-H: U1.17(INH_C)
C-L: U1.18(INL_C)
CP1: C3.1 U1.10(CP1)
CP2: C3.2 U1.11(CP2)
EN-GATE: R1.2 U1.12(EN_GATE)
ENC-A: J2.2
ENC-B: J2.1
GH-A: Q1.4(G) U1.43(GH_A)
GH-B: Q3.4(G) U1.38(GH_B)
GH-C: Q5.4(G) U1.33(GH_C)
GL-A: Q2.4(G) U1.41(GL_A)
GL-B: Q4.4(G) U1.36(GL_B)
GL-C: Q6.4(G) U1.31(GL_C)
GND: C1.2 C2.2 C9.2 C10.2 C12.2 C13.2 J2.3 Q2.1(S) Q2.2(S) Q2.3(S) Q4.1(S) Q4.2(S) Q4.3(S) Q6.1(S) Q6.2(S) Q6.3(S) U1.3(DTC) U1.8(DC_CAL) U1.24(AGND) U1.30(SL_C) U1.35(SL_B) U1.40(SL_A) U1.46(GND) U1.47(GND) U1.48(GND) U1.PAD(GND) U$1.5
GVDD: C9.1 U1.9(GVDD)
H1: U$1.3
H2: U$1.4
H3: U$1.2
MISO: U1.6(SDO)
MOSI: U1.5(SDI)
PHASE-A: C7.2 Q3.1(S) Q3.2(S) Q3.3(S) Q4.5678(D) U1.37(SH_B) U$1.10 U$1.11
PHASE-B: C6.2 Q1.1(S) Q1.2(S) Q1.3(S) Q2.5678(D) U1.42(SH_A) U$1.8 U$1.9
PHASE-C: C8.2 Q5.1(S) Q5.2(S) Q5.3(S) Q6.5678(D) U1.32(SH_C) U$1.6 U$1.7
SCK: U1.7(SCLK)
SO1: U1.21(SO1)
SO2: U1.22(SO2)
Unconnected: U1.26(SP2) U1.27(SN2) U1.28(SP1) U1.29(SN1)

### Notes on the sheet
- Bootstrapping from motor driver
  chip allows for two n-fets
- Motor Drivers and Connectors
- Large capacitors added to handle
  ripple current from motors

### Library data of the parts
C1-C3 C6-C10 = rcl:C-US: CAPACITOR, American symbol
C12 C13 = RoboJackets-Capacitors:ECA-1HHG221; DIGIKEY: P5572-ND; MANUFACTURER_PART_NUMBER: ECA-1HHG221
J2 = RoboJackets-Connectors:4-PIN_2MM-*: MPN: 0353630460; DIGIKEY: WM18933-ND; MPN: 0353630460
Q1-Q6 = RoboJackets-Discrete:IRFH7545; DIGIKEY: IRFH7545TRPBFCT-ND; MPN: IRFH7545TRPBF
R1 = rcl:R-US_: RESISTOR, American symbol
U1 = RoboJackets-PowerICs:DRV8303; DIGIKEY: 296-40070-1-ND; MPN: DRV8303DCAR
U$1 = gen3:MOTORCON: Motor Connector bottom side connector for ribbon cable

## Module DRIBBLER_DRIVE
Ports: A-H(io) A-L(io) B-H(io) B-L(io) C-H(io) C-L(io) !CS(io) MISO(io) MOSI(io) SCK(io) GND(io) +3.3V(io) +18.5V(io) !FAULT(io) !OCTW(io) H1(io) H2(io) H3(io) +5V(io)

### Library data of the parts